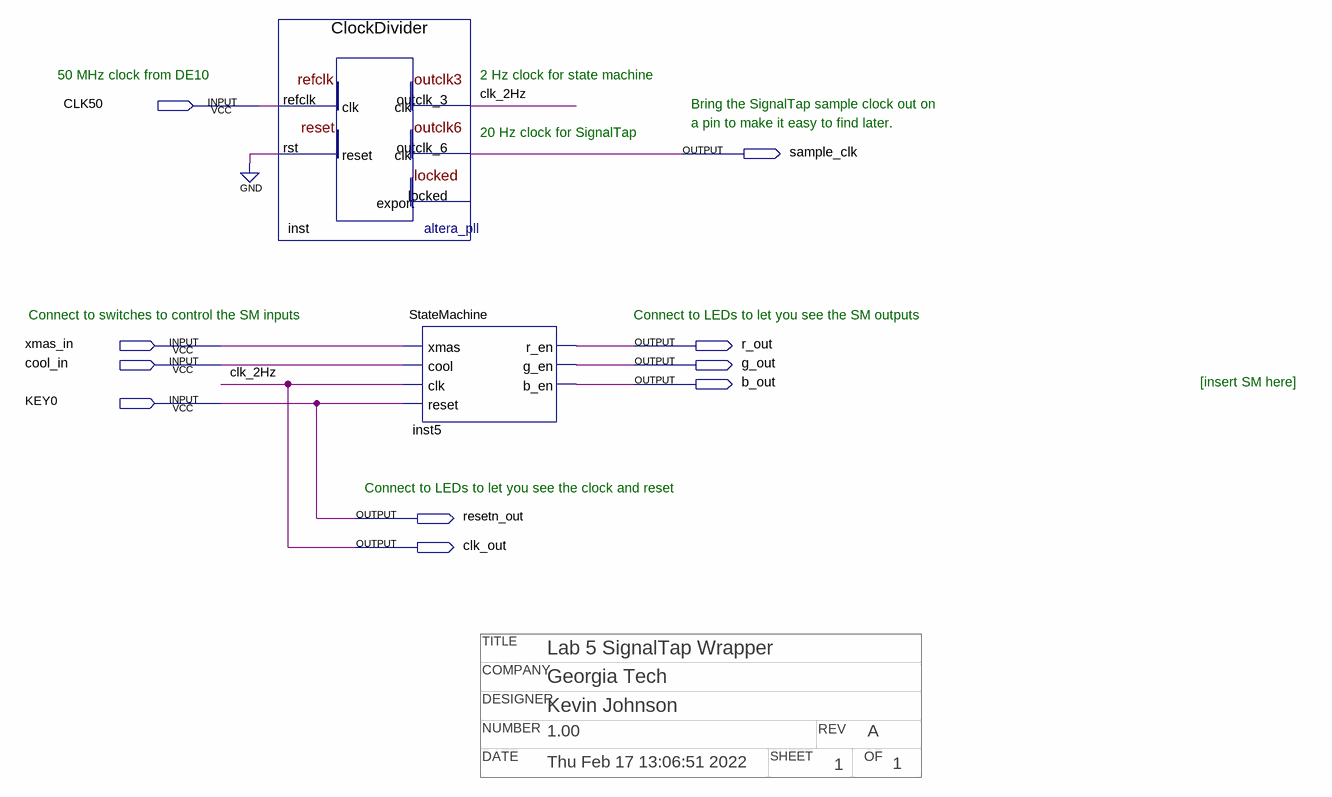
[diagram p0: schematic sheet]
// Quartus schematic Lab5Wrapper.bdf as structural Verilog: 2 symbols, 10 pins
// Title block: COMPANY: Georgia Tech; DATE: Thu Feb 17 13:06:51 2022; DESIGNER: Kevin Johnson; NUMBER: 1.00; OF: 1; REV: A; SHEET: 1; TITLE: Lab 5 SignalTap Wrapper
module Lab5Wrapper (
  input  CLK50,
  input  xmas_in,
  input  cool_in,
  input  KEY0,
  output sample_clk,
  output r_out,
  output g_out,
  output b_out,
  output resetn_out,
  output clk_out
);

  ClockDivider inst (.refclk(CLK50), .rst(1'b0), .outclk_3(clk_out), .outclk_6(sample_clk));  // open: locked
  StateMachine inst5 (
    .xmas(xmas_in), .cool(cool_in), .clk(clk_out), .reset(KEY0), .r_en(r_out), .g_en(g_out), .b_en(b_out));

  assign resetn_out = KEY0;

  // Other names for the same wires on the sheet: clk_2Hz = clk_out

  // Notes on the sheet:
  //   50 MHz clock from DE10
  //   2 Hz clock for state machine
  //   Bring the SignalTap sample clock out on
  //   a pin to make it easy to find later.
  //   20 Hz clock for SignalTap
  //   Connect to switches to control the SM inputs
  //   Connect to LEDs to let you see the SM outputs
  //   [insert SM here]
  //   Connect to LEDs to let you see the clock and reset
endmodule
